# Altium schematic sheet Power_conflict-20171010-134446.SchDoc
size A4
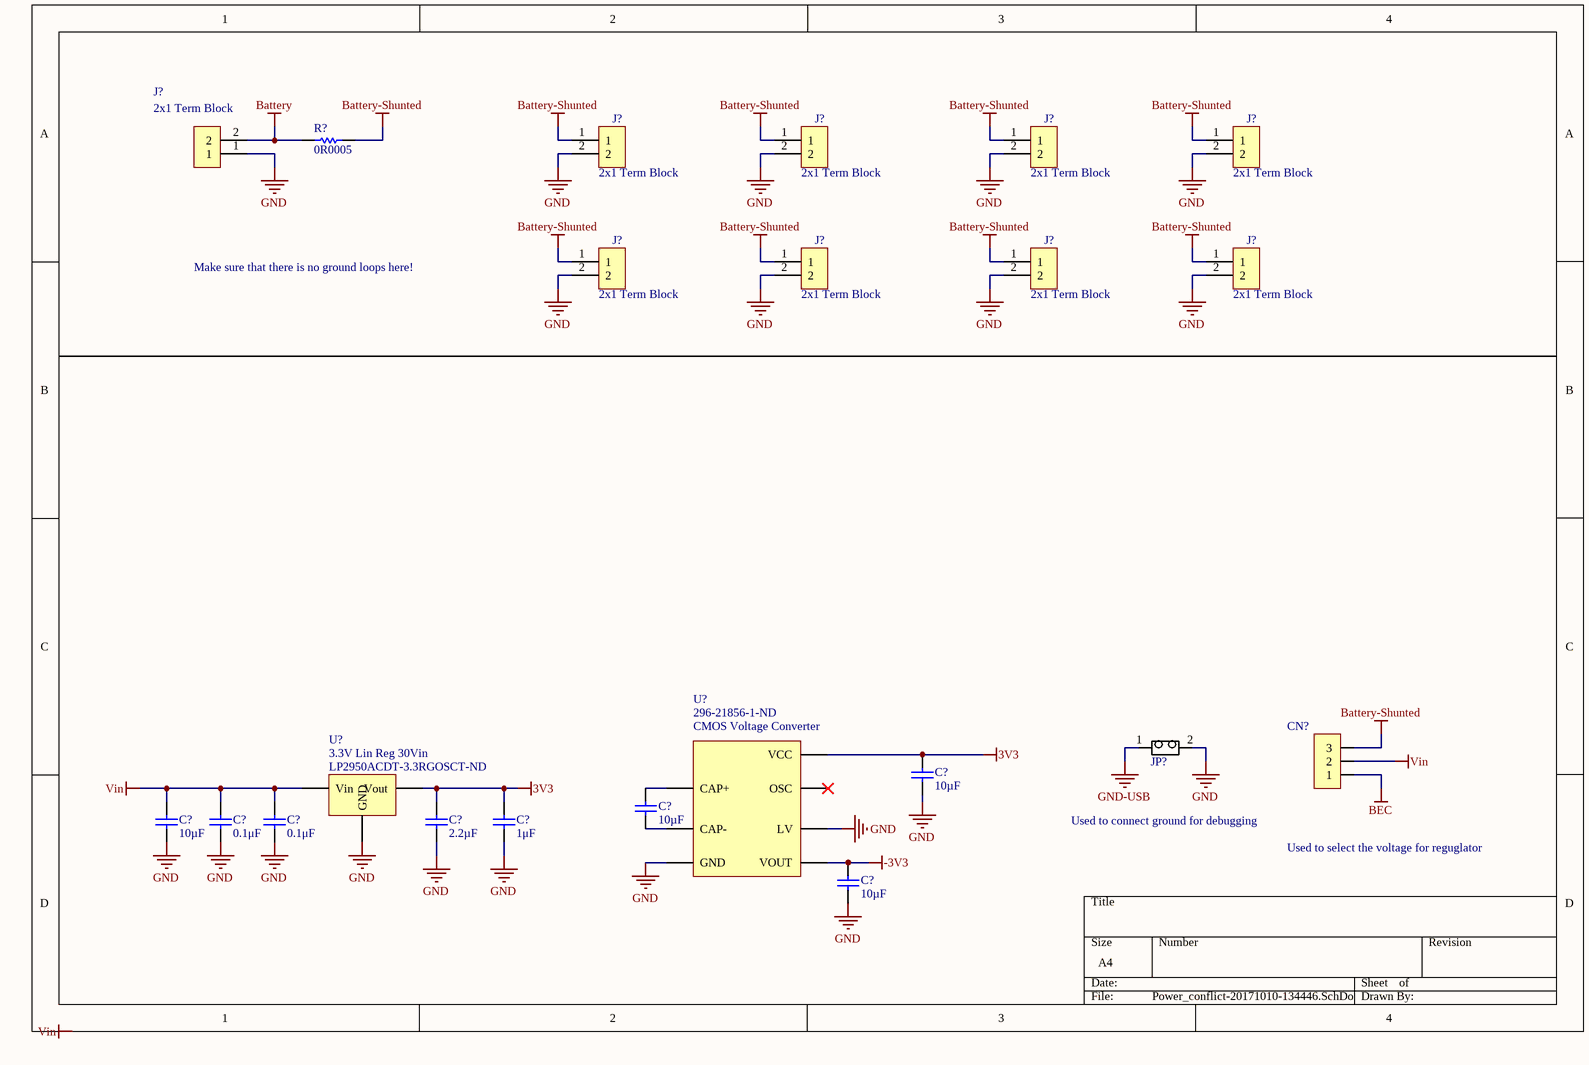
[diagram p0: Power_conflict-20171010-134446.SchDoc]

## Parts
(Parts that share a designator on the sheet are numbered #1, #2 ... from top to bottom, then left to right.)
C?#1  10µF  [CAPC2012N(0805")]
C?#2  2.2µF  [CAPC1608N(0603")]
C?#3  1μF  [CAPC1608N(0603")]
C?#4  0.1μF  [CAPC1608N(0603")]
C?#5  0.1μF  [CAPC1608N(0603")]
C?#6  10µF  [CAPC2012N(0805")]
C?#7  10µF  [CAPC2012N(0805")]
C?#8  10µF  [CAPC2012N(0805")]
CN?  Header, Male, 1x3, Pitch: 0.1" (2.54mm), THT  [Header, Male, 1x3, Pitch: 0.1" (2.54mm),THT]  (value not drawn)
J?#1  2x1 Term Block  [2X1 Terminal Blocks]
J?#2  2x1 Term Block  [2X1 Terminal Blocks]
J?#3  2x1 Term Block  [2X1 Terminal Blocks]
J?#4  2x1 Term Block  [2X1 Terminal Blocks]
J?#5  2x1 Term Block  [2X1 Terminal Blocks]
J?#6  2x1 Term Block  [2X1 Terminal Blocks]
J?#7  2x1 Term Block  [2X1 Terminal Blocks]
J?#8  2x1 Term Block  [2X1 Terminal Blocks]
J?#9  2x1 Term Block  [2X1 Terminal Blocks]
JP?  1X2 Pin Head  [2X1 Males Header]  (value not drawn)
R?  0R0005  [RESC6332N(2512")]
U?#1  3.3V Lin Reg 30Vin  Supplier Part Number 1: LP2950ACDT-3.3RGOSCT-ND  [T0-252]
U?#2  CMOS Voltage Converter  Supplier Part Number 1: 296-21856-1-ND  [8-SOIC]

## Nets
3V3: C?#1.2(Cathode) C?#2.1(Anode) C?#3.1(Anode) U?#1.3(Vout) U?#2.8(VCC)
-3V3: C?#8.2(Cathode) U?#2.5(VOUT)
Battery: J?#1.2 R?.1
Battery-Shunted: CN?.3 J?#2.1 J?#3.1 J?#4.1 J?#5.1 J?#6.1 J?#7.1 J?#8.1 J?#9.1 R?.2
BEC: CN?.1
GND: C?#1.1(Anode) C?#2.2(Cathode) C?#3.2(Cathode) C?#4.1(Anode) C?#5.1(Anode) C?#7.1(Anode) C?#8.1(Anode) J?#1.1 J?#2.2 J?#3.2 J?#4.2 J?#5.2 J?#6.2 J?#7.2 J?#8.2 J?#9.2 JP?.2 U?#1.1(GND) U?#2.3(GND) U?#2.6(LV)
GND-USB: JP?.1
Vin: C?#4.2(Cathode) C?#5.2(Cathode) C?#7.2(Cathode) CN?.2 U?#1.2(Vin)
NetC?#6_1: C?#6.1(Anode) U?#2.4(CAP-)
NetC?#6_2: C?#6.2(Cathode) U?#2.2(CAP+)

Not connected (* = marked no-connect by the designer): U?#2 7(OSC)*

## Notes on the sheet
- Make sure that there is no ground loops here!
- Used to connect ground for debugging
- Used to select the voltage for reguglator
- Labels drawn without touching a wire or pin: Vin

## Library data of the parts
C?#1 C?#6-C?#8 = 10uF 10V 0805 SMD, Ceramic: Capacitor, Ceramic, 10V, +/- 10%, 0805 SMD, X5R; Made By: Andy Bates; Published: 14-06-23; Publisher: AUVic; PackageDescription: Chip Capacitor; Value: 10µF; Supplier 1: Digi-Key; Supplier Part Number 1: 490-4735-1-ND
C?#2 = 2.2uF, 50V, 0603 SMD, X5R, Ceramic: Capacitor, Ceramic, 50V, 10%, 0603 SMD, X5R; Date Created: *; PackageDescription: Chip Capacitor; Value: 2.2µF; Made By: *; Publisher: AUVic; Supplier 1: Digi-Key; Supplier Part Number 1: 490-10733-1-ND
C?#3 = 1uF 25V 0603 SMD, Ceramic: Capacitor, Ceramic, 25V, +/- 10%, 0603 SMD, X5R; MFG: Murata-Electronics-North-America; MFG#: GRM188R61E105KA12D; Published: 16-06-27; Publisher: AUVic; PackageDescription: Chip Capacitor; Value: 1μF; Created By: Andy Bates; Supplier 1: Digi-Key; Supplier Part Number 1: 490-3897-1-ND
C?#4 C?#5 = 0.1uF 100V 0603 SMD, Ceramic: Capacitor, Ceramic, 100V, +/- 10%, 0603 SMD, X7R; MFG: TDK; MFG#: CGA3E3X7S2A104K080AB; Published: 16-04-26; Publisher: AUVic; PackageDescription: Chip Capacitor; Value: 0.1μF; Created By: Ashwin Sira; Supplier 1: Digi-Key; Supplier Part Number 1: 445-6938-1-ND
J?#1-J?#9 = 2x1 Terminal Block: Made by: Andy Bates; Supplier 1: Digikey; Supplier Part Number 1: ED2740-ND
JP? = 1x2 Male Header: Made By: Andy Bates; Supplier 1: Digikey; Supplier 1 Part Number: 952-3073-ND
R? = 0R0005, 1%, 3W, 2512 SMD: MFG: Riedon; MFG#: CSR2512C0R0005F; Last_Revision_By: Ashwin Sira; Last_Revision_Note: Made; Created By: Ashwin Sira; Created On: 2016-04-28; Value: 0R0005; Publisher: AUVic; Last_Revision_Date: 2016-04-28; Supplier 1: Digi-Key; Supplier Part Number 1: 696-1183-1-ND
U?#1 = 3.3V TO-252 Linear Regulator: Supplier 1: Digi-Key
U?#2 = TL7660: LatestRevisionDate: 17-Jul-2002; LatestRevisionNote: Re-released for DXP Platform.; Publisher: Altium Limited; Created By: Jordan; Manufacturer Part No.: TL7660; Supplier 1: Digi-Key
CN? = Header, Male, 1x3, Pitch: 0.1" (2.54mm), THT: Publisher: AUVic; Date Published: 2016-03-03; Last Updated: *; Reviewed By: *; Created By: Ashwin Sira